# Altium project STL.PrjPcb
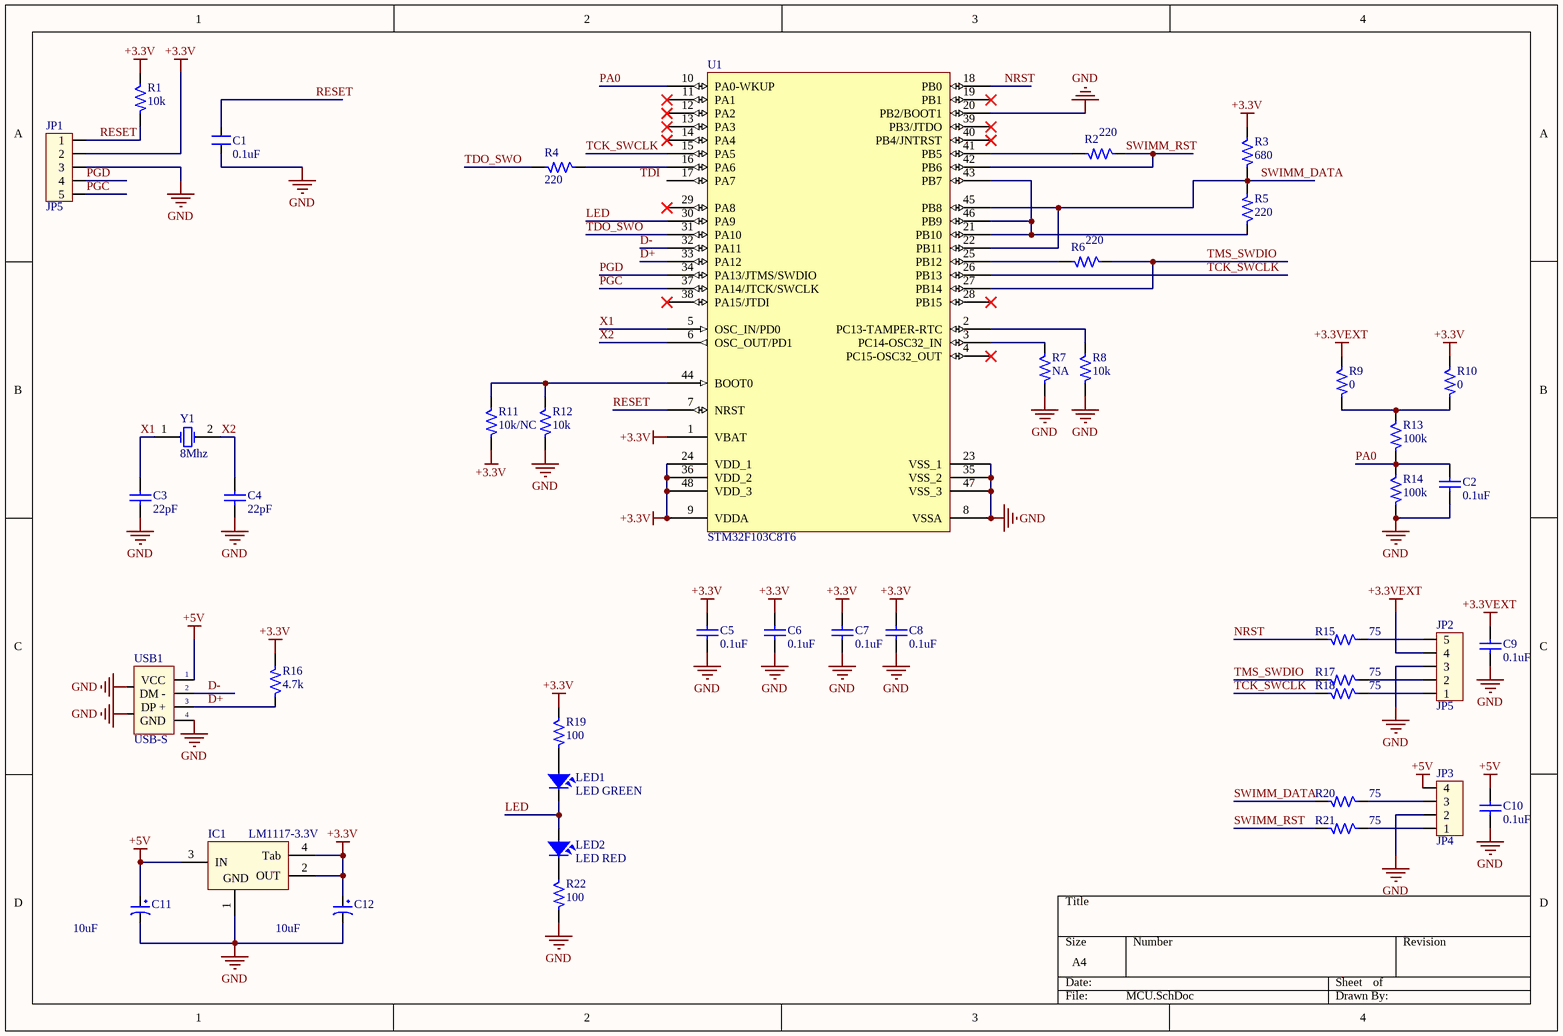
[diagram p0: MCU.SchDoc]
1 sheet, 43 parts. Net scope: global (net labels, ports and power ports of the same name join across sheets).
Board file: STL_PCB.PcbDoc

## Sheet MCU.SchDoc
size A4; SheetNumber: 1; SheetTotal: 1

### Parts
C1  0.1uF  [C0603]
C2  0.1uF  [C0603]
C3  value 22pF  [C0603]  (hidden comment: 0.1uF)
C4  value 22pF  [C0603]  (hidden comment: 0.1uF)
C5  0.1uF  [C0603]
C6  0.1uF  [C0603]
C7  0.1uF  [C0603]
C8  0.1uF  [C0603]
C9  0.1uF  [C0603]
C10  0.1uF  [C0603]
C11  10uF  [C1812]
C12  10uF  [C1812]
IC1  LM1117-3.3V  [SOT223-4N]
JP1  JP5  [CON5]
JP2  JP5  [CON5]
JP3  JP4  [CON4]
LED1  LED GREEN  [LED0603]
LED2  LED RED  [LED0603]
R1  10k  [R0603]
R2  220  [R0603]
R3  680  [R0603]
R4  220  [R0603]
R5  220  [R0603]
R6  220  [R0603]
R7  NA  [R0603]
R8  10k  [R0603]
R9  0  [R0603]
R10  0  [R0603]
R11  10k/NC  [R0603]
R12  10k  [R0603]
R13  100k  [R0603]
R14  100k  [R0603]
R15  75  [R0603]
R16  4.7k  [R0603]
R17  75  [R0603]
R18  75  [R0603]
R19  100  [R0603]
R20  75  [R0603]
R21  75  [R0603]
R22  100  [R0603]
U1  STM32F103C8T6  [LQFP48_L]
USB1  USB-S  [USB-S]
Y1  8Mhz  [XTA]

### Nets
+3.3V: C5.2 C6.2 C7.2 C8.2 C12.1 IC1.2(OUT) IC1.4(Tab) JP1.2 R1.1 R3.1 R10.1 R11.2 R16.2 R19.1 U1.1(VBAT) U1.9(VDDA) U1.24(VDD_1) U1.36(VDD_2) U1.48(VDD_3)
+3.3VEXT: C9.2 JP2.4 R9.1
+5V: C10.2 C11.1 IC1.3(IN) JP3.4 USB1.1(VCC)
GND: C1.1 C2.1 C3.1 C4.1 C5.1 C6.1 C7.1 C8.1 C9.1 C10.1 C11.2 C12.2 IC1.1(ADJ/G) JP1.3 JP2.3 JP3.2 R7.2 R8.2 R12.2 R14.2 R22.2 U1.8(VSSA) U1.20(PB2/BOOT1) U1.23(VSS_1) U1.35(VSS_2) U1.47(VSS_3) USB1.4(GND) USB1.5 USB1.6
D+: R16.1 U1.33(PA12) USB1.3(DP_+)
D-: U1.32(PA11) USB1.2(DM_-)
LED: LED1.2 LED2.1 U1.30(PA9)
NRST: R15.2 U1.18(PB0)
PA0: C2.2 R13.2 R14.1 U1.10(PA0-WKUP)
PGC: JP1.5 U1.37(PA14/JTCK/SWCLK)
PGD: JP1.4 U1.34(PA13/JTMS/SWDIO)
RESET: C1.2 JP1.1 R1.2 U1.7(NRST)
SWIMM_DATA: R3.2 R5.2 R20.2 U1.22(PB11) U1.45(PB8)
SWIMM_RST: R2.1 R21.2 U1.42(PB6)
TCK_SWCLK: R18.2 U1.15(PA5) U1.26(PB13)
TDO_SWO: R4.2 U1.31(PA10)
TMS_SWDIO: R6.1 R17.2 U1.27(PB14)
X1: C3.2 U1.5(OSC_IN/PD0) Y1.1(OSC1)
X2: C4.2 U1.6(OSC_OUT/PD1) Y1.2(OSC2)
NetJP2_1: JP2.1 R18.1
NetJP2_2: JP2.2 R17.1
NetJP2_5: JP2.5 R15.1
NetJP3_1: JP3.1 R21.1
NetJP3_3: JP3.3 R20.1
NetLED1_1: LED1.1 R19.2
NetLED2_2: LED2.2 R22.1
NetR2_2: R2.2 U1.41(PB5)
NetR4_1: R4.1 U1.16(PA6)
NetR5_1: R5.1 U1.21(PB10) U1.43(PB7) U1.46(PB9)
NetR6_2: R6.2 U1.25(PB12)
NetR7_1: R7.1 U1.3(PC14-OSC32_IN)
NetR8_1: R8.1 U1.2(PC13-TAMPER-RTC)
NetR9_2: R9.2 R10.2 R13.1
NetR11_1: R11.1 R12.1 U1.44(BOOT0)

Not connected (* = marked no-connect by the designer): U1 4(PC15-OSC32_OUT)* 11(PA1)* 12(PA2)* 13(PA3)* 14(PA4)* 17(PA7) 19(PB1)* 28(PB15)* 29(PA8)* 38(PA15/JTDI)* 39(PB3/JTDO)* 40(PB4/JNTRST)*

### Notes on the sheet
- Labels drawn without touching a wire or pin: TDI
- (in symbol LM1117) GND

### Library data of the parts
C1 = CAP: Cremic For Xtal 1pF => 100pF; Value: 33pF
C2-C10 = Cap Semi: Capacitor (Semiconductor SIM Model); Published: 8-Jun-2000; LatestRevisionDate: 29-May-2009; LatestRevisionNote: IPC-7351 Footprint Added.; PackageReference: C1206; Publisher: Altium Limited; PackageDescription: Chip Capacitor
  C2 C5-C10: Value: 0.1uF
C11 C12 = CP1: Cap P  0,1uF < 22uF , 16 - 50V; Value: 10uF/50V; Description 1: 10 => 220uF/6,3V/10V - 10uF => 100uF/16V; Description 2: 0,1uF => 33uF/50V - 10uF => 22uF/63V; Description 3: 0,47uF => 10uF/100V
IC1 = LM1117: 3v3; Value: LM317
JP1 JP2 = Con5: Connector 5; Value: Connector 5
JP3 = Con4: Connector 4; Value: Connector 4
LED1 LED2 = LED: LED Single colour Green and Red; Value: LED 3 ly Single Colour
R1-R22 = R: Resistor 1/4W; Value: R1/4W - 1K
U1 = STM32F103C8T6: STM32 ARM-based 32-bit MCU with 64 Kbytes Flash, 48-pin LQFP, Industrial Temperature; Published: 30-May-2008; DatasheetVersion: rev6, Mar-2008; PackageVersion: Mar-2008; PackageReference: LQFP48; Publisher: Altium Limited; PackageDescription: 48-Pin Low-Profile Quad Flat Pack, 7 x 7 mm Body, 0.5 mm Pitch (LQFP48); ComponentLink1Description: Manufacturer Link; ComponentLink1URL: www.st.com/stm32; ComponentLink2Description: Datasheet; ComponentLink2URL: http://www.st.com/stonline/products/literature/ds/13587.pdf
USB1 = USB_S: USB connector; Value: USB
Y1 = XTAL: Crystal Oscillator; Published: 8-Jun-2000; LatestRevisionDate: 17-Jul-2002; LatestRevisionNote: Re-released for DXP Platform.; PackageReference: R38; Publisher: Altium Limited; PackageDescription: Crystal, Thru-Hole; 2 Leads; Body 3.1 x 8.2 mm (Dia.xH)